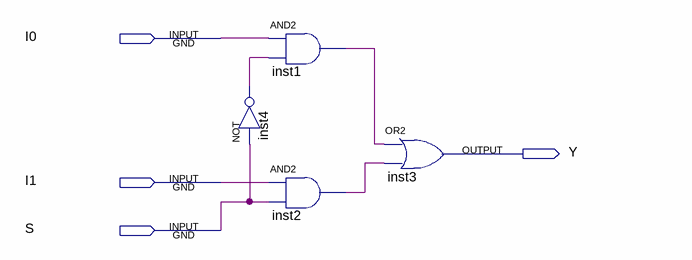
[diagram p0: schematic sheet]
// Quartus schematic MUX2to1.bdf as structural Verilog: 4 symbols, 4 pins
module MUX2to1 (
  input  I0,
  input  I1,
  input  S,
  output Y
);

  wire inst1_out, inst2_out, inst4_out;

  not inst4 (inst4_out, S);
  and inst1 (inst1_out, I0, inst4_out);
  and inst2 (inst2_out, I1, S);
  or inst3 (Y, inst1_out, inst2_out);
endmodule
